# Altium schematic sheet Output - Motor Units.SchDoc
size A
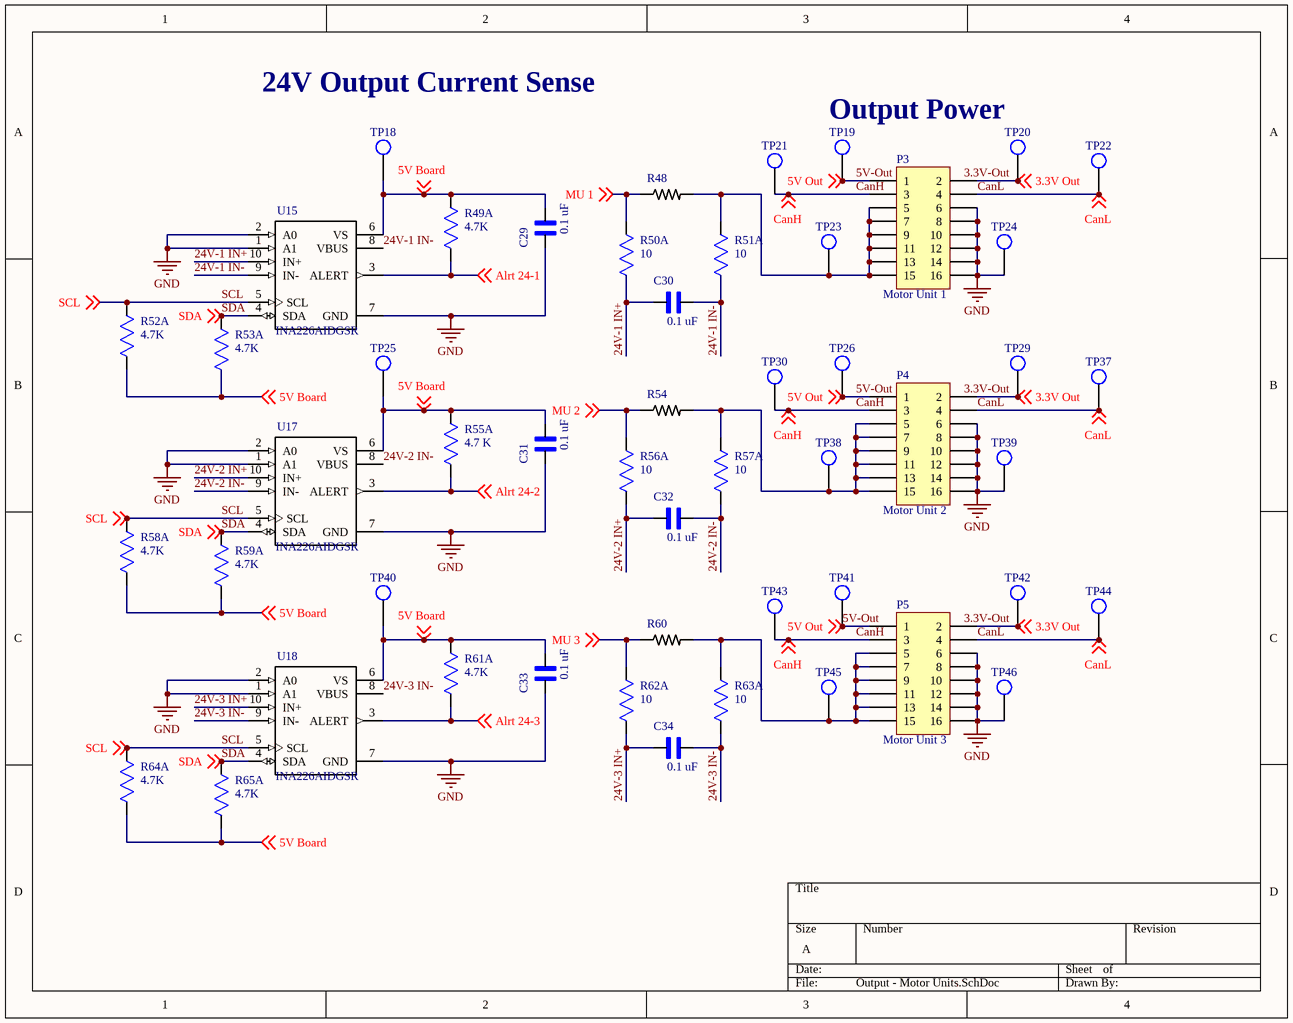
[diagram p0: Output - Motor Units.SchDoc]

## Parts
C29  0.1 uF  [*CAPC2012X135N]
C30  0.1 uF  [*CAPC2012X135N]
C31  0.1 uF  [*CAPC2012X135N]
C32  0.1 uF  [*CAPC2012X135N]
C33  0.1 uF  [*CAPC2012X135N]
C34  0.1 uF  [*CAPC2012X135N]
P3  Motor Unit 1  [HDR2X8]
P4  Motor Unit 2  [HDR2X8]
P5  Motor Unit 3  [HDR2X8]
R48  1-1879378-2  [*RESC6331X70N]  (value not drawn)
R49  4.7K  [RC0805N]  (part A of 2)
R50  10  [RC0805N]  (part A of 2)
R51  10  [RC0805N]  (part A of 2)
R52  4.7K  [RC0805N]  (part A of 2)
R53  4.7K  [RC0805N]  (part A of 2)
R54  1-1879378-2  [*RESC6331X70N]  (value not drawn)
R55  4.7 K  [RC0805N]  (part A of 2)
R56  10  [RC0805N]  (part A of 2)
R57  10  [RC0805N]  (part A of 2)
R58  4.7K  [RC0805N]  (part A of 2)
R59  4.7K  [RC0805N]  (part A of 2)
R60  1-1879378-2  [*RESC6331X70N]  (value not drawn)
R61  4.7K  [RC0805N]  (part A of 2)
R62  10  [RC0805N]  (part A of 2)
R63  10  [RC0805N]  (part A of 2)
R64  4.7K  [RC0805N]  (part A of 2)
R65  4.7K  [RC0805N]  (part A of 2)
TP18  Test Point  [Test Point Through-hole]  (value not drawn)
TP19  Test Point  [Test Point Through-hole]  (value not drawn)
TP20  Test Point  [Test Point Through-hole]  (value not drawn)
TP21  Test Point  [Test Point Through-hole]  (value not drawn)
TP22  Test Point  [Test Point Through-hole]  (value not drawn)
TP23  Test Point  [Test Point Through-hole]  (value not drawn)
TP24  Test Point  [Test Point Through-hole]  (value not drawn)
TP25  Test Point  [Test Point Through-hole]  (value not drawn)
TP26  Test Point  [Test Point Through-hole]  (value not drawn)
TP29  Test Point  [Test Point Through-hole]  (value not drawn)
TP30  Test Point  [Test Point Through-hole]  (value not drawn)
TP37  Test Point  [Test Point Through-hole]  (value not drawn)
TP38  Test Point  [Test Point Through-hole]  (value not drawn)
TP39  Test Point  [Test Point Through-hole]  (value not drawn)
TP40  Test Point  [Test Point Through-hole]  (value not drawn)
TP41  Test Point  [Test Point Through-hole]  (value not drawn)
TP42  Test Point  [Test Point Through-hole]  (value not drawn)
TP43  Test Point  [Test Point Through-hole]  (value not drawn)
TP44  Test Point  [Test Point Through-hole]  (value not drawn)
TP45  Test Point  [Test Point Through-hole]  (value not drawn)
TP46  Test Point  [Test Point Through-hole]  (value not drawn)
U15  INA226AIDGSR  [*SOP50P490X110-10N]
U17  INA226AIDGSR  [*SOP50P490X110-10N]
U18  INA226AIDGSR  [*SOP50P490X110-10N]

## Nets
GND: C29.1 C31.1 C33.1 P3.6 P3.8 P3.10 P3.12 P3.14 P3.16 P4.6 P4.8 P4.10 P4.12 P4.14 P4.16 P5.6 P5.8 P5.10 P5.12 P5.14 P5.16 TP24.1 TP39.1 TP46.1 U15.1(A1) U15.2(A0) U15.7(GND) U17.1(A1) U17.2(A0) U17.7(GND) U18.1(A1) U18.2(A0) U18.7(GND)
3.3V Out: P3.2 P4.2 P5.2 TP20.1 TP29.1 TP42.1 ; off-sheet 3.3V Out
5V Board : C29.2 C31.2 C33.2 R49.1 R53.2 R55.1 R61.1 TP18.1 TP25.1 TP40.1 U15.6(VS) U17.6(VS) U18.6(VS) ; off-sheet 5V Board 
5V-Out: P3.1 P4.1 P5.1 TP19.1 TP26.1 TP41.1 ; off-sheet 5V Out  [also labelled 5V Out]
24V-1 IN+: C30.1 R50.2 U15.10(IN+)
24V-1 IN-: C30.2 R51.2 U15.8(VBUS) U15.9(IN-)
24V-2 IN+: C32.1 U17.10(IN+)
24V-2 IN-: C32.2 U17.8(VBUS) U17.9(IN-)
24V-3 IN+: C34.1 U18.10(IN+)
24V-3 IN-: C34.2 U18.8(VBUS) U18.9(IN-)
Alrt 24-1: U15.3(ALERT) ; off-sheet Alrt 24-1
Alrt 24-2: U17.3(ALERT) ; off-sheet Alrt 24-2
Alrt 24-3: U18.3(ALERT) ; off-sheet Alrt 24-3
CanH: P3.3 P4.3 P5.3 TP21.1 TP30.1 TP43.1 ; off-sheet CanH
CanL: P3.4 P4.4 P5.4 TP22.1 TP37.1 TP44.1 ; off-sheet CanL
MU 1: R48.1 R50.1 ; off-sheet MU 1
MU 2: R54.1 R56.1 ; off-sheet MU 2
MU 3: R60.1 R62.1 ; off-sheet MU 3
SCL: R52.1 R58.1 R64.1 U15.5(SCL) U17.5(SCL) U18.5(SCL) ; off-sheet SCL
SDA: R53.1 R59.1 R65.1 U15.4(SDA) U17.4(SDA) U18.4(SDA) ; off-sheet SDA
NetP3_5: P3.5 P3.7 P3.9 P3.11 P3.13 P3.15 R48.2 R51.1 TP23.1
NetP4_5: P4.5 P4.7 P4.9 P4.11 P4.13 P4.15 R54.2 R57.1 TP38.1
NetP5_5: P5.5 P5.7 P5.9 P5.11 P5.13 P5.15 R60.2 R63.1 TP45.1

Not connected (* = marked no-connect by the designer): R49 2; R52 2; R55 2; R56 2; R57 2; R58 2; R59 2; R61 2; R62 2; R63 2; R64 2; R65 2

## Notes on the sheet
- 24V Output Current Sense
- Output Power
- Labels drawn without touching a wire or pin: 3.3V-Out

## Library data of the parts
C29-C34 = EMK212BJ225KG-T: / Cap Ceramic 2.2uF 16V X5R 10% SMD 0805 125Â°C Embossed T/R /; MF: Taiyo Yuden; MP: EMK212BJ225KG-T; Package: 2012 Taiyo Yuden; Digi-Key_Purchase_URL: https://www.digikey.com/product-detail/en/taiyo-yuden/EMK212BJ225KG-T/587-1293-1-ND/931070?utm_source=snapeda&utm_medium=aggregator&utm_campaign=symbol; Digi-Key_Part_Number: 587-1293-1-ND; SnapEDA_Link: https://www.snapeda.com/parts/EMK212BJ225KG-T/Taiyo%20Yuden/view-part/?ref=snap; Value: *
P3-P5 = Header 8X2: Header, 8-Pin, Dual row; LatestRevisionDate: 17-Jul-2002; LatestRevisionNote: Re-released for DXP Platform.; Publisher: Altium Limited
R48 R54 R60 = TLR3A20KR003FTDG: TLR 2512 2.0W R003 1% 150PPM 2K RL; Power_Rating: 2 W; MF: TE Connectivity; Resistance: .003; MP: TLR3A20KR003FTDG; Digi-Key_Purchase_URL: https://www.digikey.com/product-detail/en/te-connectivity-passive-product/TLR3A20KR003FTDG/A131783CT-ND/8603913?utm_source=snapeda&utm_medium=aggregator&utm_campaign=symbol; SnapEDA_Link: https://www.snapeda.com/parts/TLR3A20KR003FTDG/TE%20Connectivity/view-part/1169417/?ref=snap; TE_purchase_URL: https://www.te.com/usa-en/product-1-1879378-2.html?te_bu=Cor&te_type=disp&te_campaign=seda_glo_cor-seda-global-disp-prtnr-fy19-seda-model-bom-cta_sma-317_1&elqCampaignId=32493; Package: 2512; Digi-Key_Part_Number: A131783CT-ND; EU_RoHS_Compliance: Compliant; Tolerance: 1%; Value: *
R49-R53 R55-R59 R61-R65 = CRCW0805681RFKEA: No Description Available; Manufacturer_Part_Number: CRCW0805681RFKEA_1; Vendor: Vishay; Built_By: EMA_UL_Team; Copyright: Copyright (C) 2018 Accelerated Designs. All rights reserved; RefDes: RefDes; Type: DEV; Value: Value
U15 U17 U18 = INA226AIDGSR: Current Monitor Regulator High/Low-Side 10mA 10-VSSOP; MF: Texas Instruments; Digi-Key_Part_Number: 296-29034-1-ND; SnapEDA_Link: https://www.snapeda.com/parts/INA226AIDGSR/Texas%20Instruments/view-part/53552/?ref=snap; Package: MSOP-10 Texas Instruments; MP: INA226AIDGSR; Digi-Key_Purchase_URL: https://www.digikey.com/product-detail/en/texas-instruments/INA226AIDGSR/296-29034-1-ND/2687118?utm_source=snapeda&utm_medium=aggregator&utm_campaign=symbol; Value: *